# EAGLE design clocky (EAGLE 6.3)
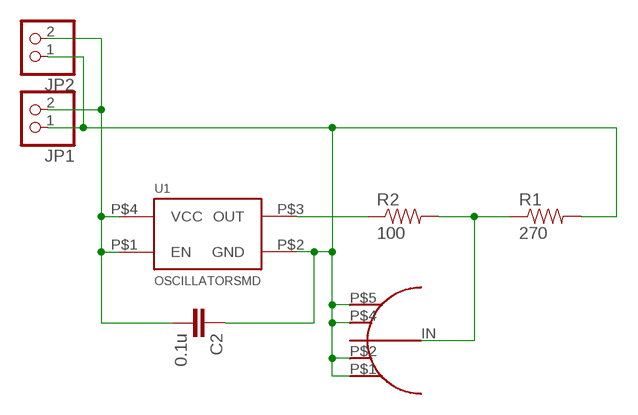
[diagram p0: schematic, sheet 1]

## Parts
C2  0.1u  CAP0603-CAP  [0603-CAP]
JP1  PINHD-1X2/90  [1X02/90]
JP2  PINHD-1X2  [1X02]
R1  270  RESISTOR0603-RES  [0603-RES]
R2  100  RESISTOR0603-RES  [0603-RES]
U1  OSCILLATORSMD  [CRYSTAL-SMD-7X5]
U$1  J658  [SMA_J658]

## Nets
3V3: C2.2 JP1.2 JP2.2 U1.P$1(EN) U1.P$4(VCC)
GND: C2.1 JP1.1 JP2.1 R1.2 U1.P$2(GND) U$1.P$1(GNDA) U$1.P$2(GNDB) U$1.P$4(GNDC) U$1.P$5(GNDD)
N$1: R2.1 U1.P$3(OUT)
N$2: R1.1 R2.2 U$1.IN

## Library data of the parts
C2 = SparkFun-Capacitors:CAP: Capacitor Standard 0603 ceramic capacitor, and 0.1" leaded capacitor.
JP1 JP2 = pinhead:PINHD-1X2: PIN HEADER
R1 R2 = SparkFun-Resistors:RESISTOR: Resistor Basic schematic elements and footprints for 0603, 1206, and PTH resistors.
U1 = SparkFun-FreqCtrl:OSCILLATOR: Generic 5x3 and 7x5 oscillators
U$1 = CustomRF:J658

## Board
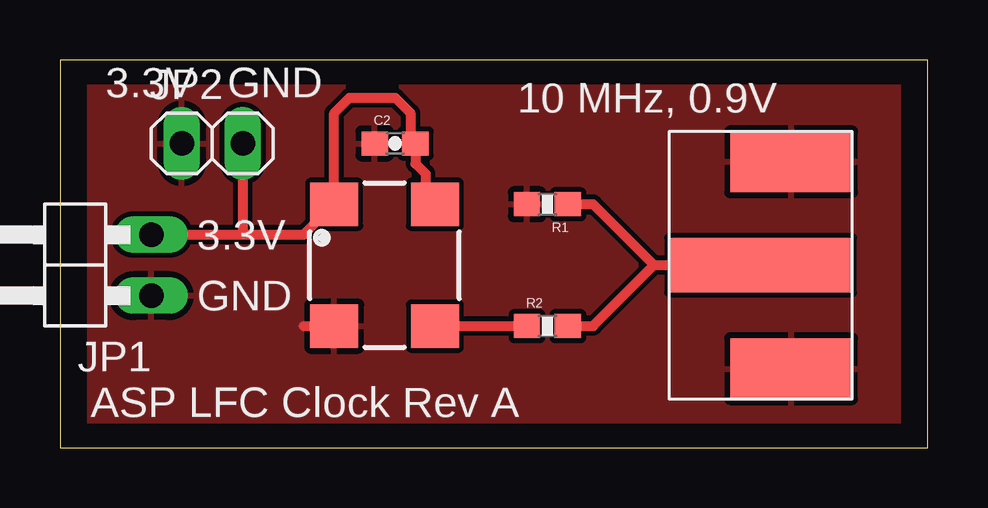
[diagram p1: board, top side]
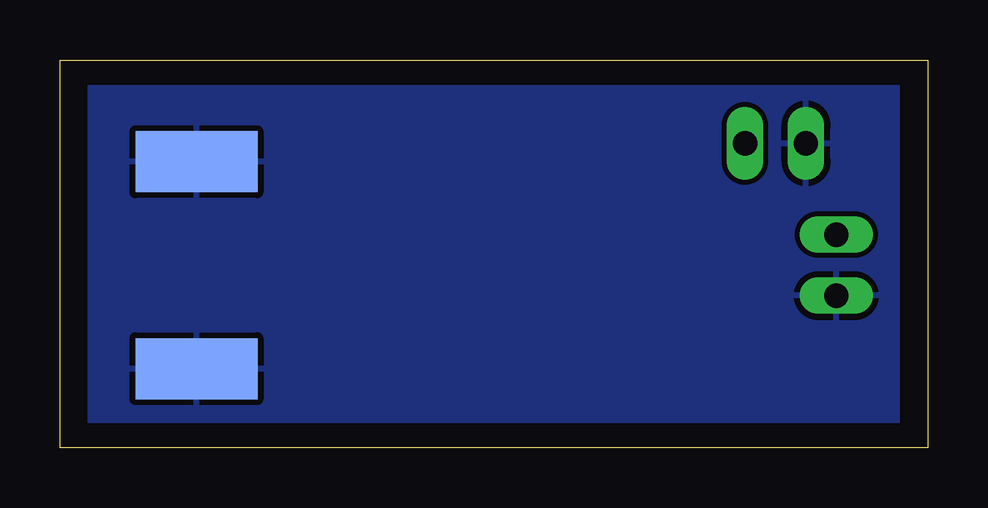
[diagram p2: board, bottom side, seen from below]

Size 36.17 x 16.18 mm. Coordinates in mm from the lower left corner, seen from the top.
Outline: 0,0 36.17,0 36.17,16.18 0,16.18 0,0
Copper layers (1*16): Top 0.035mm / dielectric 1.5mm / Bottom 0.035mm
Design rules "default": minimum track width 10mil, minimum drill 24mil, track to track 8mil, track to pad 8mil, pad to pad 8mil, via to via 8mil, smd to smd 8mil, copper to edge 40mil, drill to drill 8mil, minimum pad ring 10mil, minimum via ring 8mil, stop-mask expansion 4mil, vias tented up to drill 0mil, thermal gap 10mil

### Footprints (pad centres in the part's own frame; a part is rotated, then mirrored left to right if it is on the bottom)
0603-CAP = smd 1.1 x 1: 1 -0.85,0; 2 0.85,0
1X02/90 = drill 1.016 long: 1 -1.27,-3.81; 2 1.27,-3.81
1X02 = drill 1.016 long: 1 -1.27,0; 2 1.27,0
0603-RES = smd 1.1 x 1: 1 -0.85,0; 2 0.85,0
CRYSTAL-SMD-7X5 = smd 1.8 x 2: P$1 0,0; P$2 5.08,0; P$3 5.08,4.2; P$4 0,4.2
SMA_J658 = smd 2.286 x 7.62: IN 0,0 | smd 2.54 x 5.08: P$1 -4.318,1.27; P$2 4.318,1.27 | smd 2.54 x 5.08 bottom: P$4 -4.318,1.27; P$5 4.318,1.27

### Placement (x,y rotation side)
C2  13.97,12.7 0 top
JP1  0,7.62 90 top
JP2  6.35,12.7 0 top
R1  20.32,10.16 180 top
R2  20.32,5.08 0 top
U1  11.43,10.16 270 top
U$1  29.21,7.62 270 top

### Tracks (layer width: path | path; a pad name or v marks a point on that pad's centre or on a via)
3V3
  Top 0.406: JP1.2 7.62,8.89 | 7.62,8.89 10.16,8.89 U1.P$1 11.43,13.97 12.06,14.61 13.97,14.61 14.61,13.97 14.61,12.91 C2.2 14.82,11.85 15.24,11.43 15.24,10.55 U1.P$4 14.92,10.87 | JP2.2 7.62,8.89
GND
  Top 0.406: 10.16,5.08 U1.P$2
  pour Bottom: 1.27,15.24 34.92,15.24 34.92,0.63 1.27,0.63
  pour Top: 1.27,15.24 34.92,15.24 34.92,0.63 1.27,0.63
N$1
  Top 0.406: U1.P$3 R2.1
N$2
  Top 0.406: R2.2 22.23,5.08 24.77,7.62 | 24.77,7.62 U$1.IN | R1.1 22.23,10.16 24.77,7.62

### Text on the board
tPlace: 3.3V | GND | 10 MHz, 0.9V | 3.3V | GND | ASP LFC Clock Rev A